# Altium schematic sheet Sheet1.SchDoc
size A4
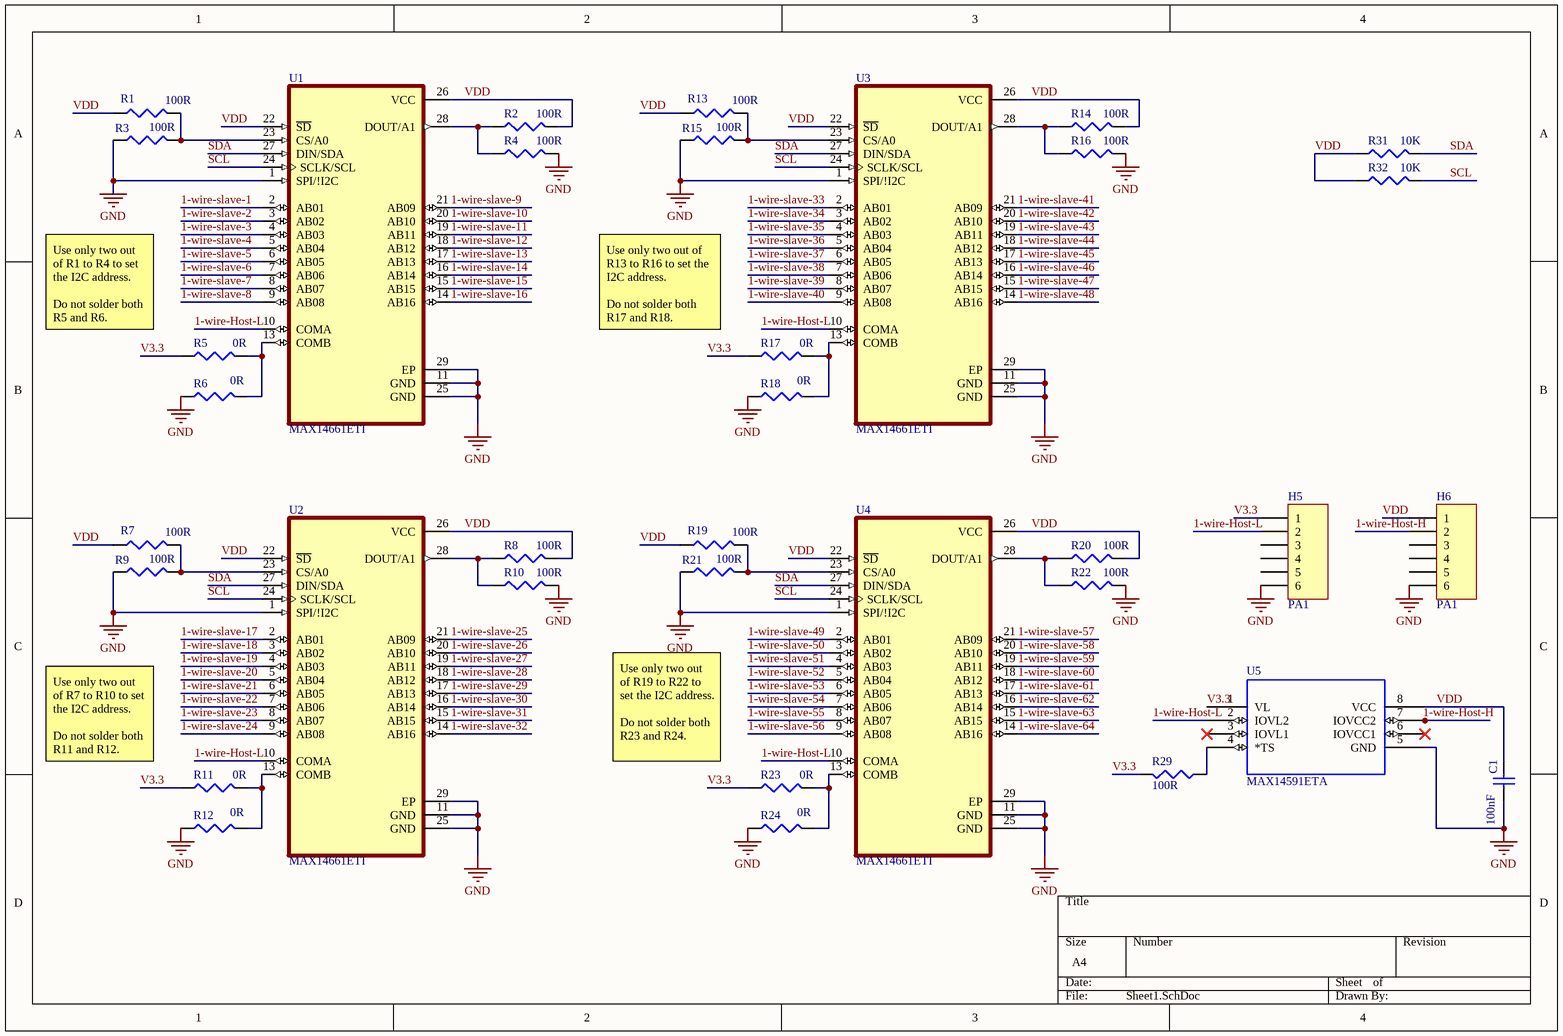
[diagram p0: Sheet1.SchDoc]

## Parts
C1  value 100nF  [CAPC1608L]
H5  PA1  [HDR1X6]
H6  PA1  [HDR1X6]
R1  value 100R  [J1-0603]
R2  value 100R  [J1-0603]
R3  value 100R  [J1-0603]
R4  value 100R  [J1-0603]
R5  value 0R  [J1-0603]
R6  value 0R  [J1-0603]
R7  value 100R  [J1-0603]
R8  value 100R  [J1-0603]
R9  value 100R  [J1-0603]
R10  value 100R  [J1-0603]
R11  value 0R  [J1-0603]
R12  value 0R  [J1-0603]
R13  value 100R  [J1-0603]
R14  value 100R  [J1-0603]
R15  value 100R  [J1-0603]
R16  value 100R  [J1-0603]
R17  value 0R  [J1-0603]
R18  value 0R  [J1-0603]
R19  value 100R  [J1-0603]
R20  value 100R  [J1-0603]
R21  value 100R  [J1-0603]
R22  value 100R  [J1-0603]
R23  value 0R  [J1-0603]
R24  value 0R  [J1-0603]
R29  value 100R  [J1-0603]
R31  value 10K  [J1-0603]
R32  value 10K  [J1-0603]
U1  MAX14661ETI  [QFN40P400X400X80-29N]
U2  MAX14661ETI  [QFN40P400X400X80-29N]
U3  MAX14661ETI  [QFN40P400X400X80-29N]
U4  MAX14661ETI  [QFN40P400X400X80-29N]
U5  MAX14591ETA  [21-0487A]

## Nets
GND: C1.2 H5.6 H6.6 R3.1 R4.1 R6.1 R9.1 R10.1 R12.1 R15.1 R16.1 R18.1 R21.1 R22.1 R24.1 U1.1(SPI/!I2C) U1.11(GND) U1.25(GND) U1.29(EP) U2.1(SPI/!I2C) U2.11(GND) U2.25(GND) U2.29(EP) U3.1(SPI/!I2C) U3.11(GND) U3.25(GND) U3.29(EP) U4.1(SPI/!I2C) U4.11(GND) U4.25(GND) U4.29(EP) U5.5(GND)
1-wire-Host-H: H6.2 U5.7(IOVCC2)
1-wire-Host-L: H5.2 U1.10(COMA) U2.10(COMA) U3.10(COMA) U4.10(COMA) U5.2(IOVL2)
1-wire-slave-1: U1.2(AB01)
1-wire-slave-2: U1.3(AB02)
1-wire-slave-3: U1.4(AB03)
1-wire-slave-4: U1.5(AB04)
1-wire-slave-5: U1.6(AB05)
1-wire-slave-6: U1.7(AB06)
1-wire-slave-7: U1.8(AB07)
1-wire-slave-8: U1.9(AB08)
1-wire-slave-9: U1.21(AB09)
1-wire-slave-10: U1.20(AB10)
1-wire-slave-11: U1.19(AB11)
1-wire-slave-12: U1.18(AB12)
1-wire-slave-13: U1.17(AB13)
1-wire-slave-14: U1.16(AB14)
1-wire-slave-15: U1.15(AB15)
1-wire-slave-16: U1.14(AB16)
1-wire-slave-17: U2.2(AB01)
1-wire-slave-18: U2.3(AB02)
1-wire-slave-19: U2.4(AB03)
1-wire-slave-20: U2.5(AB04)
1-wire-slave-21: U2.6(AB05)
1-wire-slave-22: U2.7(AB06)
1-wire-slave-23: U2.8(AB07)
1-wire-slave-24: U2.9(AB08)
1-wire-slave-25: U2.21(AB09)
1-wire-slave-26: U2.20(AB10)
1-wire-slave-27: U2.19(AB11)
1-wire-slave-28: U2.18(AB12)
1-wire-slave-29: U2.17(AB13)
1-wire-slave-30: U2.16(AB14)
1-wire-slave-31: U2.15(AB15)
1-wire-slave-32: U2.14(AB16)
1-wire-slave-33: U3.2(AB01)
1-wire-slave-34: U3.3(AB02)
1-wire-slave-35: U3.4(AB03)
1-wire-slave-36: U3.5(AB04)
1-wire-slave-37: U3.6(AB05)
1-wire-slave-38: U3.7(AB06)
1-wire-slave-39: U3.8(AB07)
1-wire-slave-40: U3.9(AB08)
1-wire-slave-41: U3.21(AB09)
1-wire-slave-42: U3.20(AB10)
1-wire-slave-43: U3.19(AB11)
1-wire-slave-44: U3.18(AB12)
1-wire-slave-45: U3.17(AB13)
1-wire-slave-46: U3.16(AB14)
1-wire-slave-47: U3.15(AB15)
1-wire-slave-48: U3.14(AB16)
1-wire-slave-49: U4.2(AB01)
1-wire-slave-50: U4.3(AB02)
1-wire-slave-51: U4.4(AB03)
1-wire-slave-52: U4.5(AB04)
1-wire-slave-53: U4.6(AB05)
1-wire-slave-54: U4.7(AB06)
1-wire-slave-55: U4.8(AB07)
1-wire-slave-56: U4.9(AB08)
1-wire-slave-57: U4.21(AB09)
1-wire-slave-58: U4.20(AB10)
1-wire-slave-59: U4.19(AB11)
1-wire-slave-60: U4.18(AB12)
1-wire-slave-61: U4.17(AB13)
1-wire-slave-62: U4.16(AB14)
1-wire-slave-63: U4.15(AB15)
1-wire-slave-64: U4.14(AB16)
SCL: R32.1 U1.24(SCLK/SCL) U2.24(SCLK/SCL) U3.24(SCLK/SCL) U4.24(SCLK/SCL)
SDA: R31.1 U1.27(DIN/SDA) U2.27(DIN/SDA) U3.27(DIN/SDA) U4.27(DIN/SDA)
V3.3: H5.1 R5.1 R11.1 R17.1 R23.1 R29.1 U5.1(VL)
VDD: C1.1 H6.1 R1.1 R2.1 R7.1 R8.1 R13.1 R14.1 R19.1 R20.1 R31.2 R32.2 U1.22(~{SD}) U1.26(VCC) U2.22(~{SD}) U2.26(VCC) U3.22(~{SD}) U3.26(VCC) U4.22(~{SD}) U4.26(VCC) U5.8(VCC)
NetR1_2: R1.2 R3.2 U1.23(CS/A0)
NetR2_2: R2.2 R4.2 U1.28(DOUT/A1)
NetR5_2: R5.2 R6.2 U1.13(COMB)
NetR7_2: R7.2 R9.2 U2.23(CS/A0)
NetR8_2: R8.2 R10.2 U2.28(DOUT/A1)
NetR11_2: R11.2 R12.2 U2.13(COMB)
NetR13_2: R13.2 R15.2 U3.23(CS/A0)
NetR14_2: R14.2 R16.2 U3.28(DOUT/A1)
NetR17_2: R17.2 R18.2 U3.13(COMB)
NetR19_2: R19.2 R21.2 U4.23(CS/A0)
NetR20_2: R20.2 R22.2 U4.28(DOUT/A1)
NetR23_2: R23.2 R24.2 U4.13(COMB)
NetR29_2: R29.2 U5.4(*TS)

Not connected (* = marked no-connect by the designer): H5 3 4 5; H6 3 4 5; U5 3(IOVL1)* 6(IOVCC1)*

## Notes on the sheet
- (near R5) Use only two out of R1 to R4 to set the I2C address.
  Do not solder both R5 and R6.
- (near R17) Use only two out of R13 to R16 to set the I2C address.
  Do not solder both R17 and R18.
- (near R11) Use only two out of R7 to R10 to set the I2C address.
  Do not solder both R11 and R12.
- (near R23) Use only two out of R19 to R22 to set the I2C address.
  Do not solder both R23 and R24.

## Library data of the parts
C1 = Cap Semi: Capacitor (Semiconductor SIM Model); Published: 8-Jun-2000; LatestRevisionDate: 29-May-2009; LatestRevisionNote: IPC-7351 Footprint Added.; PackageReference: C1206; Publisher: Altium Limited; PackageDescription: Chip Capacitor
H5 H6 = Header 6: Header, 6-Pin; LatestRevisionDate: 17-Jul-2002; LatestRevisionNote: Re-released for DXP Platform.; Publisher: Altium Limited
R1-R24 R29 R31 R32 = Res3: Resistor; Published: 8-Jun-2000; LatestRevisionDate: 29-May-2009; LatestRevisionNote: IPC-7351 Footprint Added.; PackageReference: J1-0603; Publisher: Altium Limited; PackageDescription: Chip Resistor
U1-U4 = MAX14661ETI: None; MF: {'manufacturer': u'Maxim Integrated'}; Price: None; Availability: Unavailable; Value: *; MP: MAX14661ETI; Package: None
U5 = MAX14591ETA: MF: {'manufacturer': u'Maxim Integrated'}; MP: MAX14591ETA; Value: *; Package: None; Price: None; Availability: Unavailable